# EAGLE schematic APP_UD_new (EAGLE 6.6.0)
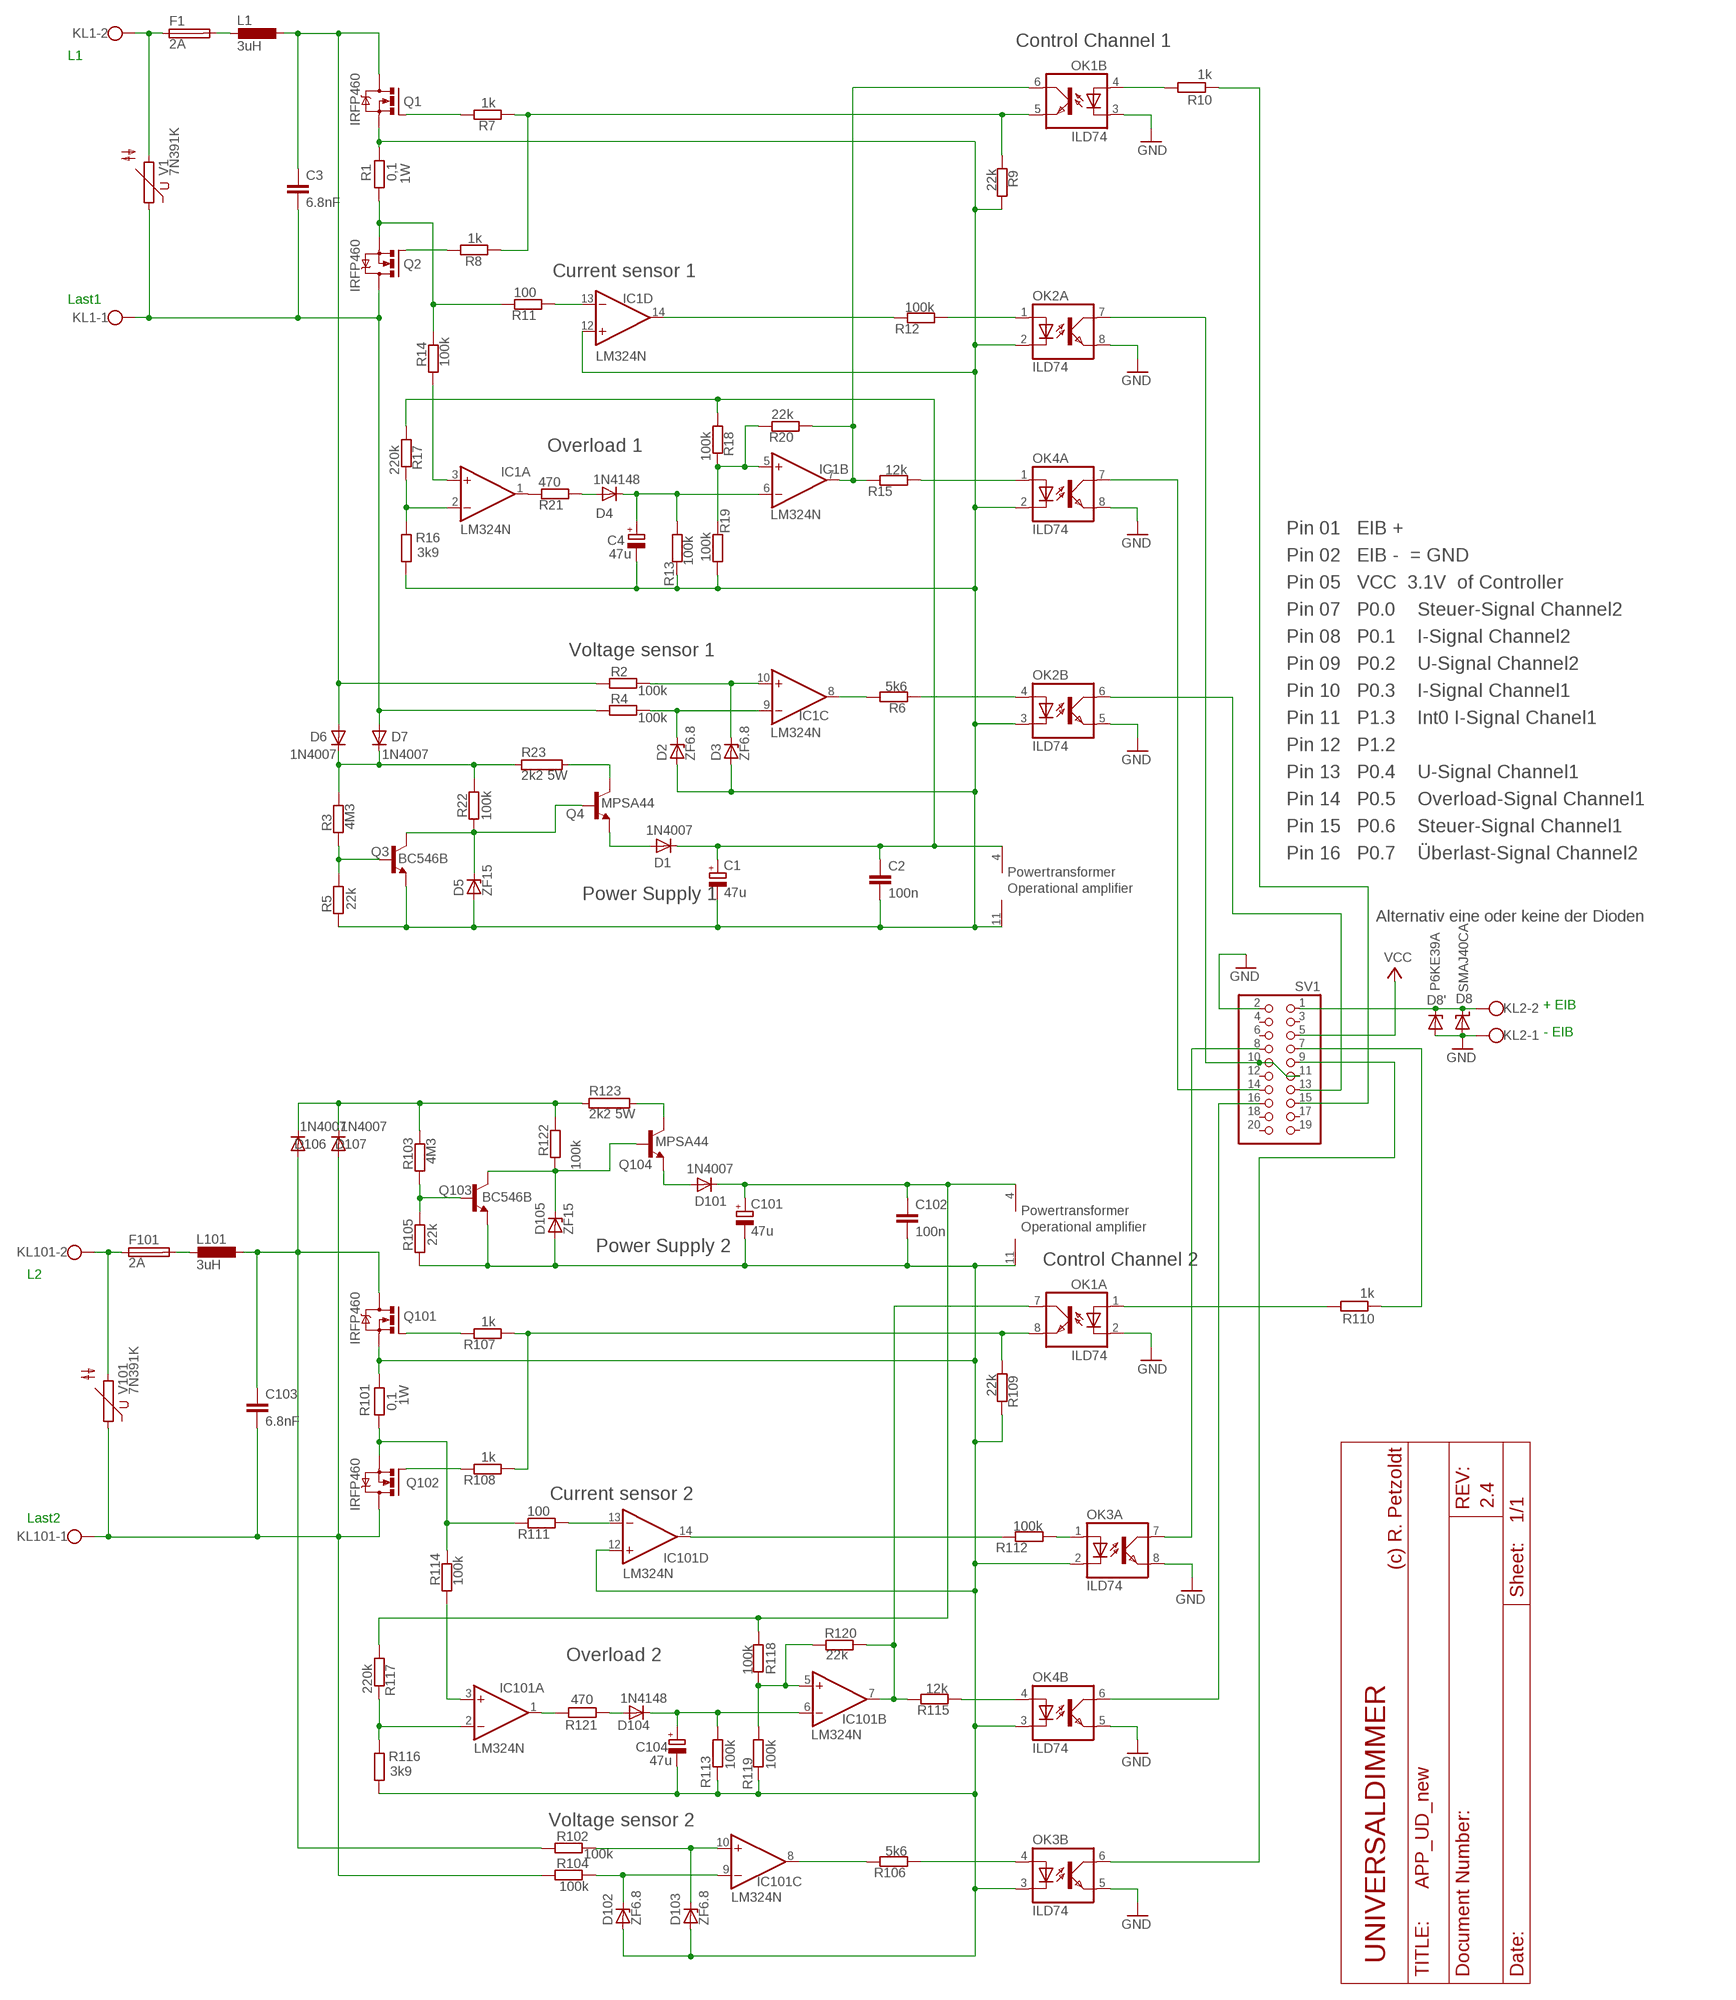
[diagram p0: schematic, sheet 1]
UNIVERSALDIMMER (DOCFIELD): COPYRIGHT: (c) R. Petzoldt; REV: 2.4

## Parts
C1  47u  CPOL-EUE2-5  [E2-5]
C2  100n  C-EU025-030X050  [C025-030X050]
C3  6.8nF  C-EU050-075X075  [C050-075X075]
C4  47u  CPOL-EUE2-5  [E2-5]
C101  47u  CPOL-EUE2-5  [E2-5]
C102  100n  C-EU025-030X050  [C025-030X050]
C103  6.8nF  C-EU050-075X075  [C050-075X075]
C104  47u  CPOL-EUE2-5  [E2-5]
D1  1N4007  1N4148DO35-7S  [D-7]
D2  ZF6.8  ZENER-DIODEZD-5  [ZDIO-5]
D3  ZF6.8  ZENER-DIODEZD-7.5  [ZDIO-7.5]
D4  1N4148  1N4148DO35-7S  [D-7]
D5  ZF15  ZENER-DIODEZD-7.5  [ZDIO-7.5]
D6  1N4007  DIODE-D-7.5  [D-7.5]
D7  1N4007  DIODE-D-7.5  [D-7.5]
D8  SMAJ40CA  SUPPRESSOR-SMBJ  [SMBJ]
D8'  P6KE39A  ZENER-DIODEZD-7.5  [ZDIO-7.5]
D101  1N4007  1N4148DO35-7S  [D-7]
D102  ZF6.8  ZENER-DIODEZD-5  [ZDIO-5]
D103  ZF6.8  ZENER-DIODEZD-7.5  [ZDIO-7.5]
D104  1N4148  1N4148DO35-7S  [D-7]
D105  ZF15  ZENER-DIODEZD-7.5  [ZDIO-7.5]
D106  1N4007  DIODE-D-7.5  [D-7.5]
D107  1N4007  DIODE-D-7.5  [D-7.5]
F1  2A  TR5  [TR5]
F101  2A  TR5  [TR5]
IC1  LM324N  [DIL14]
IC101  LM324N  [DIL14]
KL1  W237-102  [W237-102]
KL2  W237-102  [W237-102]
KL101  W237-102  [W237-102]
L1  3uH  L-EU414V  [0414V]
L101  3uH  L-EU414V  [0414V]
OK1  ILD74  ILD2  [DIL08]
OK2  ILD74  ILD2  [DIL08]
OK3  ILD74  ILD2  [DIL08]
OK4  ILD74  ILD2  [DIL08]
Q1  IRFP460  IRFPC40  [TO247BV]
Q2  IRFP460  IRFPC40  [TO247BV]
Q3  BC546B  [TO92-EBC]
Q4  MPSA44  MPSA44-NPN-TO92-EBC  [TO92-EBC]
Q101  IRFP460  IRFPC40  [TO247BV]
Q102  IRFP460  IRFPC40  [TO247BV]
Q103  BC546B  [TO92-EBC]
Q104  MPSA44  MPSA44-NPN-TO92-EBC  [TO92-EBC]
R1  0,1  R-EU_0414/5V  [0414V]
R2  100k  R-EU_0204/7  [0204/7]
R3  4M3  R-EU_0204/7  [0204/7]
R4  100k  R-EU_0204/7  [0204/7]
R5  22k  R-EU_0204/7  [0204/7]
R6  5k6  R-EU_0204/7  [0204/7]
R7  1k  R-EU_0204/7  [0204/7]
R8  1k  R-EU_0204/7  [0204/7]
R9  22k  R-EU_0204/7  [0204/7]
R10  1k  R-EU_0204/7  [0204/7]
R11  100  R-EU_0204/7  [0204/7]
R12  100k  R-EU_0204/7  [0204/7]
R13  100k  R-EU_0204/7  [0204/7]
R14  100k  R-EU_0204/7  [0204/7]
R15  12k  R-EU_0204/7  [0204/7]
R16  3k9  R-EU_0204/7  [0204/7]
R17  220k  R-EU_0204/7  [0204/7]
R18  100k  R-EU_0204/7  [0204/7]
R19  100k  R-EU_0204/7  [0204/7]
R20  22k  R-EU_0204/7  [0204/7]
R21  470  R-EU_0204/7  [0204/7]
R22  100k  R-EU_0204/7  [0204/7]
R23  2k2 5W  R  [KH208-8_10B]
R101  0,1  R-EU_0414/5V  [0414V]
R102  100k  R-EU_0204/7  [0204/7]
R103  4M3  R-EU_0204/7  [0204/7]
R104  100k  R-EU_0204/7  [0204/7]
R105  22k  R-EU_0204/7  [0204/7]
R106  5k6  R-EU_0204/7  [0204/7]
R107  1k  R-EU_0204/7  [0204/7]
R108  1k  R-EU_0204/7  [0204/7]
R109  22k  R-EU_0204/7  [0204/7]
R110  1k  R-EU_0204/7  [0204/7]
R111  100  R-EU_0204/7  [0204/7]
R112  100k  R-EU_0207/12  [0207/12]
R113  100k  R-EU_0204/7  [0204/7]
R114  100k  R-EU_0204/7  [0204/7]
R115  12k  R-EU_0204/7  [0204/7]
R116  3k9  R-EU_0204/7  [0204/7]
R117  220k  R-EU_0204/7  [0204/7]
R118  100k  R-EU_0204/7  [0204/7]
R119  100k  R-EU_0204/7  [0204/7]
R120  22k  R-EU_0204/7  [0204/7]
R121  470  R-EU_0204/7  [0204/7]
R122  100k  R-EU_0204/7  [0204/7]
R123  2k2 5W  R  [KH208-8_10B]
SV1  PINHD-2X10  [2X10]
V1  7N391K  S05K11  [S05K11]
V101  7N391K  S05K11  [S05K11]

## Nets
AGND1: C1.- C2.2 C4.- D2.A D3.A D5.A IC1.11(P:V-) IC1.12(D:+IN) OK2.2(A:C) OK2.3(B:C) OK4.2(A:C) Q1.S Q3.E R1.2 R5.1 R9.2 R13.2 R16.2 R19.1
AGND2: C101.- C102.2 C104.- D102.A D103.A D105.A IC101.11(P:V-) IC101.12(D:+IN) OK3.2(A:C) OK3.3(B:C) OK4.3(B:C) Q101.S Q103.E R101.2 R105.1 R109.2 R113.2 R116.2 R119.2
GND: D8'.A D8.A KL2.1 OK1.2(A:C) OK1.3(B:C) OK2.5(B:EMIT) OK2.8(A:EMIT) OK3.5(B:EMIT) OK3.8(A:EMIT) OK4.5(B:EMIT) OK4.8(A:EMIT) SV1.2
N$1: R10.1 SV1.15
N$2: OK1.4(B:A) R10.2
N$3: C3.1 D6.A L1.1 Q1.D R2.1
N$4: Q2.S R1.1 R11.2 R14.2
N$5: OK2.6(B:COL) SV1.13
N$6: IC1.7(B:OUT) OK1.6(B:COL) R15.2 R20.1
N$7: OK2.7(A:COL) SV1.10 SV1.11
N$8: F1.1 KL1.2 V1.2
N$9: Q2.G R8.2
N$10: OK1.1(A:A) R110.2
N$11: IC1.3(A:+IN) R14.1
N$12: D6.C D7.C R3.2 R22.2 R23.P$1
N$13: OK2.4(B:A) R6.1
N$14: IC101.7(B:OUT) OK1.7(A:COL) R115.2 R120.2
N$15: IC1.8(C:OUT) R6.2
N$16: Q3.B R3.1 R5.2
N$17: Q1.G R7.2
N$18: C3.2 D7.A KL1.1 Q2.D R4.1 V1.1
N$20: D8'.C D8.C KL2.2 SV1.1
N$21: IC1.2(A:-IN) R16.1 R17.2
N$22: F1.2 L1.2
N$23: D3.C IC1.10(C:+IN) R2.2
N$24: D2.C IC1.9(C:-IN) R4.2
N$25: IC1.1(A:OUT) R21.2
N$26: C103.2 D107.A KL101.1 Q102.D R104.1 V101.1
N$27: OK3.1(A:A) R112.1
N$28: OK2.1(A:A) R12.1
N$30: C4.+ D4.C IC1.6(B:-IN) R13.1
N$31: D5.C Q3.C Q4.B R22.1
N$32: OK4.1(A:A) R15.1
N$33: OK4.7(A:COL) SV1.14
N$34: IC1.5(B:+IN) R18.2 R19.2 R20.2
N$35: Q4.C R23.P$2
N$36: OK1.8(A:EMIT) R107.1 R108.1 R109.1
N$38: Q102.S R101.1 R111.2 R114.2
N$40: Q102.G R108.2
N$42: D106.C D107.C R103.2 R122.2 R123.P$1
N$43: D103.C IC101.10(C:+IN) R102.2
N$44: D102.C IC101.9(C:-IN) R104.2
N$45: OK3.4(B:A) R106.1
N$46: IC101.8(C:OUT) R106.2
N$47: D1.A Q4.E
N$48: IC1.14(D:OUT) R12.2
N$49: Q103.B R103.1 R105.2
N$50: OK3.6(B:COL) SV1.9
N$51: OK3.7(A:COL) SV1.8
N$52: R110.1 SV1.7
N$53: Q101.G R107.2
N$54: IC101.13(D:-IN) R111.1
N$55: D105.C Q103.C Q104.B R122.1
N$57: IC101.3(A:+IN) R114.1
N$58: IC101.2(A:-IN) R116.1 R117.2
N$59: IC101.1(A:OUT) R121.2
N$60: C104.+ D104.C IC101.6(B:-IN) R113.1
N$61: OK4.4(B:A) R115.1
N$62: OK4.6(B:COL) SV1.16
N$63: Q104.C R123.P$2
N$64: D4.A R21.1
N$65: D104.A R121.1
N$66: IC101.5(B:+IN) R118.2 R119.1 R120.1
N$68: D101.A Q104.E
N$69: OK1.5(B:EMIT) R7.1 R8.1 R9.1
N$71: F101.1 KL101.2 V101.2
N$72: IC101.14(D:OUT) R112.2
N$73: F101.2 L101.2
N$74: IC1.13(D:-IN) R11.1
N$75: C103.1 D106.A L101.1 Q101.D R102.1
V12-C1: C1.+ C2.1 D1.C IC1.4(P:V+) R17.1 R18.1
V12-C2: C101.+ C102.1 D101.C IC101.4(P:V+) R117.1 R118.1
VCC: SV1.5
Unconnected: SV1.3 SV1.4 SV1.6 SV1.12 SV1.17 SV1.18 SV1.19 SV1.20

## Notes on the sheet
- Control Channel 1
- L1
- 1W
- Current sensor 1
- Last1
- Overload 1
- Pin 01   EIB +
- Pin 02   EIB -  = GND
- Pin 05   VCC  3.1V  of Controller
- Pin 07   P0.0    Steuer-Signal Channel2
- Pin 08   P0.1    I-Signal Channel2
- Voltage sensor 1
- Pin 09   P0.2    U-Signal Channel2
- Pin 10   P0.3    I-Signal Channel1
- Pin 11   P1.3    Int0 I-Signal Chanel1
- Pin 12   P1.2
- Pin 13   P0.4    U-Signal Channel1
- Pin 14   P0.5    Overload-Signal Channel1
- Pin 15   P0.6    Steuer-Signal Channel1
- Pin 16   P0.7    Überlast-Signal Channel2
- Powertransformer
- Operational amplifier
- Power Supply 1
- Alternativ eine oder keine der Dioden
- + EIB
- - EIB
- Powertransformer
- Operational amplifier
- Power Supply 2
- Control Channel 2
- L2
- 1W
- Current sensor 2
- Last2
- Overload 2
- Voltage sensor 2

## Library data of the parts
C1 C4 C101 C104 = rcl:CPOL-EU: POLARIZED CAPACITOR, European symbol
C2 C3 C102 C103 = rcl:C-EU: CAPACITOR, European symbol
D1 D4 D101 D104 = diode:1N4148: DIODE high speed (Philips)
D2 D3 D5 D8' D102 D103 D105 = diode:ZENER-DIODE: Z-Diode
D6 D7 D106 D107 = diode:DIODE-: DIODE
D8 = diode:SUPPRESSOR-: Suppressor diode
F1 F101 = fuse:TR5: FUSE Wickmann
IC1 IC101 = linear:LM324: OP AMP
KL1 KL2 KL101 = con-wago-500:W237-102: WAGO SCREW CLAMP
L1 L101 = rcl:L-EU: INDUCTOR, European symbol
OK1-OK4 = optocoupler:ILD2: SIEMENS OPTO COUPLER
Q1 Q2 Q101 Q102 = transistor-power:IRFPC40: N-CHANNEL MOS FET
Q3 Q103 = transistor-npn:BC546*: NPN Transistor
Q4 Q104 = transistor:*-NPN-: NPN Transistror BF959 corrected 2008.03.06
R1-R22 R101-R122 = rcl:R-EU_: RESISTOR, European symbol
R23 R123 = resistor-power:R: Power Resitor
SV1 = pinhead:PINHD-2X10: PIN HEADER
V1 V101 = varistor:S05K11: VARISTOR